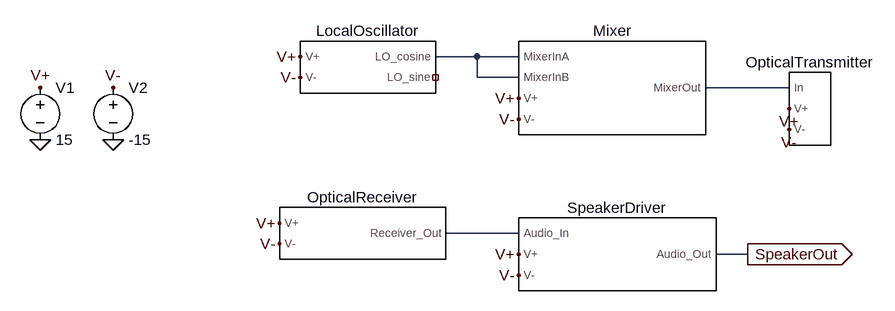
[diagram p0: schematic Combined.asc]
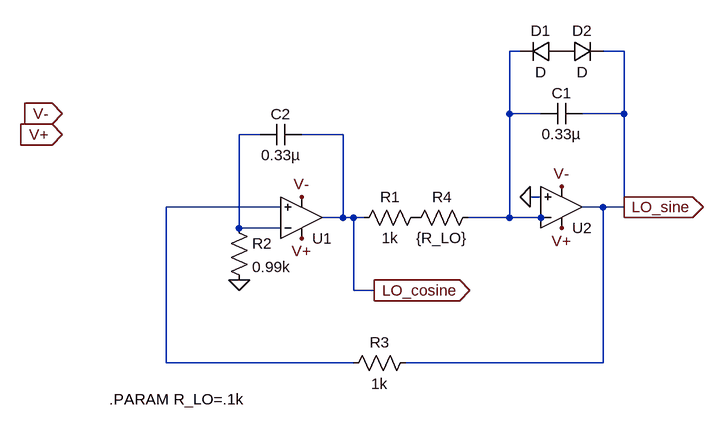
[diagram p1: sub-circuit localoscillator.asc]
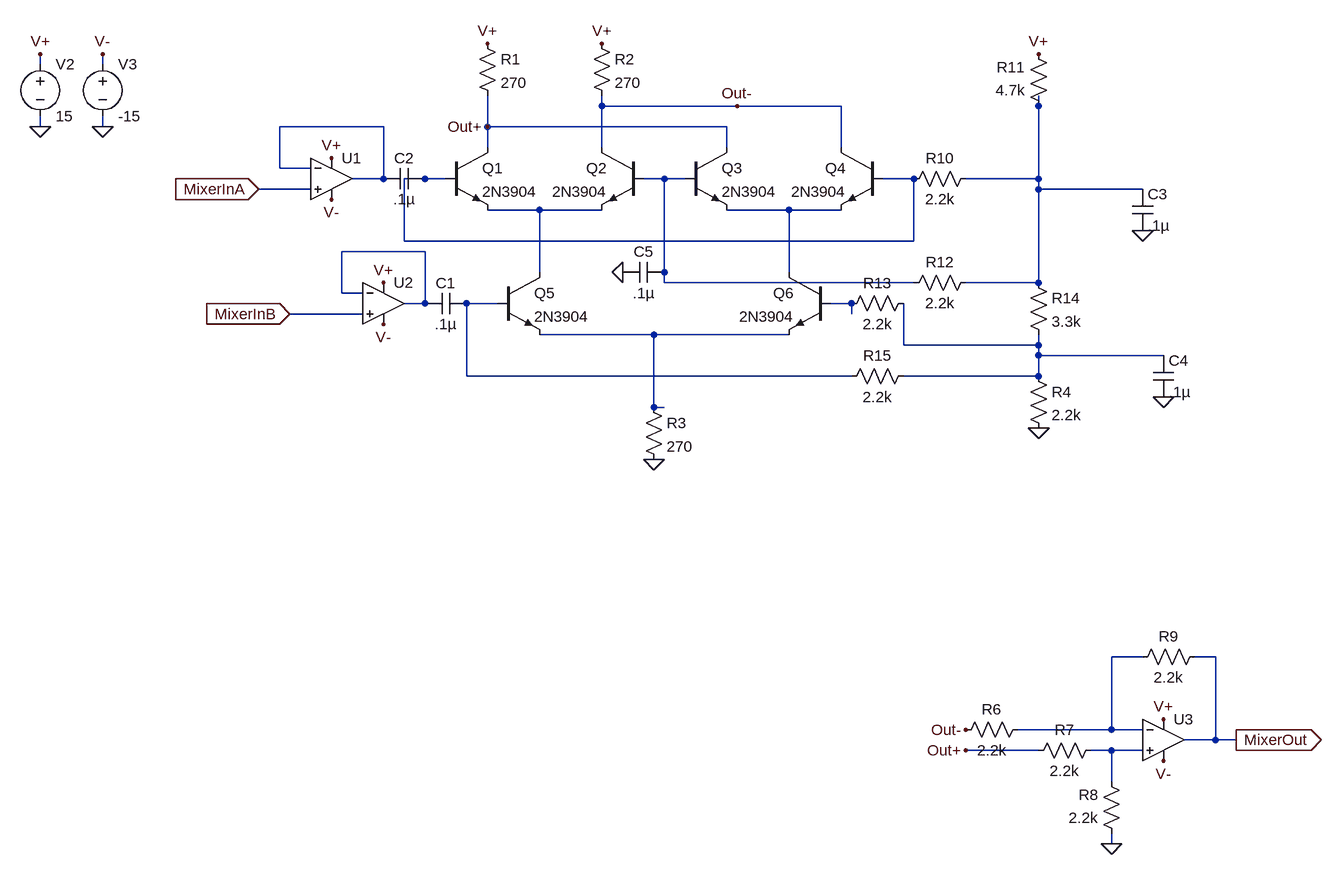
[diagram p2: sub-circuit mixer.asc]
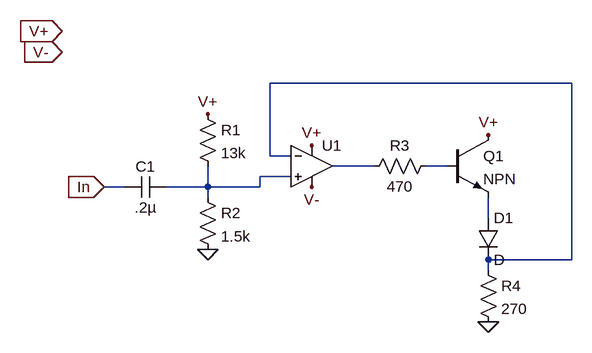
[diagram p3: sub-circuit opticaltransmitter.asc]
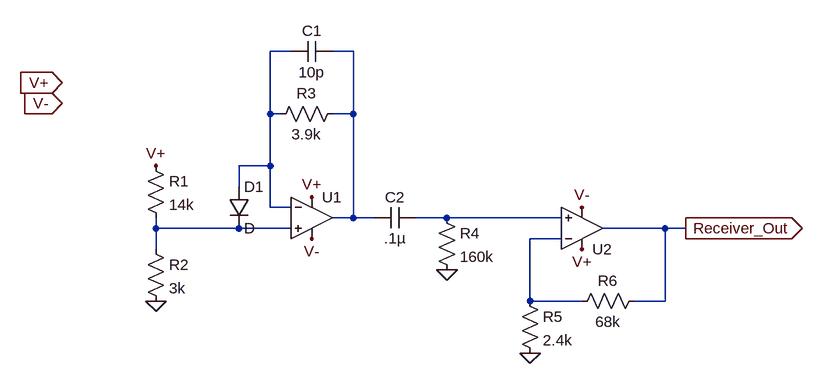
[diagram p4: sub-circuit opticalreceiver.asc]
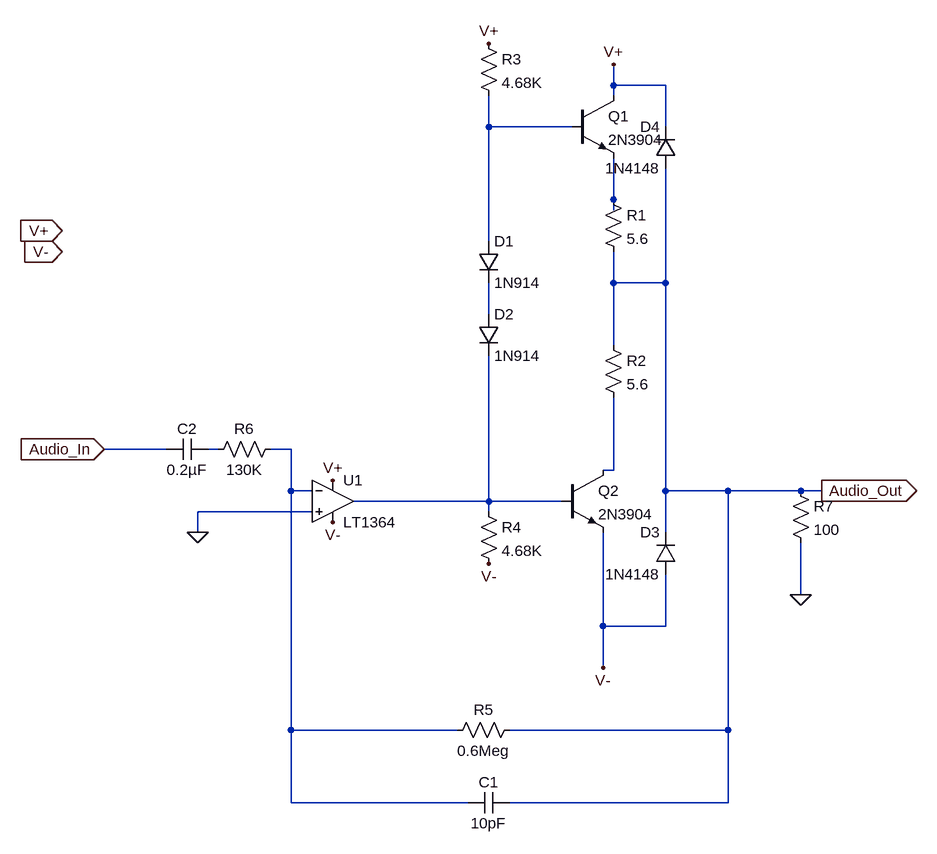
[diagram p5: sub-circuit speakerdriver.asc]
Combined.asc, the LTspice schematic file:
Version 4
SHEET 1 980 680
WIRE 288 -192 224 -192
WIRE 352 -192 288 -192
WIRE 288 -160 288 -192
WIRE 352 -160 288 -160
WIRE 768 -144 640 -144
WIRE 352 80 240 80
WIRE 704 112 656 112
FLAG -384 -64 0
FLAG -272 -64 0
FLAG 704 112 SpeakerOut
IOPIN 704 112 Out
FLAG 16 -192 V+
FLAG 352 -128 V+
FLAG 768 -112 V+
FLAG -16 64 V+
FLAG 352 112 V+
FLAG 16 -160 V-
FLAG 352 -96 V-
FLAG 768 -80 V-
FLAG -16 96 V-
FLAG 352 144 V-
FLAG -384 -144 V+
FLAG -272 -144 V-
SYMBOL voltage -384 -160 R0
WINDOW 123 0 0 Left 0
WINDOW 39 0 0 Left 0
SYMATTR InstName V1
SYMATTR Value 15
SYMBOL voltage -272 -160 R0
WINDOW 123 0 0 Left 0
WINDOW 39 0 0 Left 0
SYMATTR InstName V2
SYMATTR Value -15
SYMBOL LocalOscillator 112 -176 R0
SYMATTR InstName LocalOscillator
SYMBOL Mixer 496 -144 R0
SYMATTR InstName Mixer
SYMBOL OpticalTransmitter 800 -112 R0
SYMATTR InstName OpticalTransmitter
SYMBOL OpticalReceiver 112 80 R0
SYMATTR InstName OpticalReceiver
SYMBOL SpeakerDriver 496 112 R0
SYMATTR InstName SpeakerDriver

localoscillator.asc, the sub-circuit schematic file:
Version 4
SHEET 1 880 680
WIRE 448 -256 432 -256
WIRE 608 -256 576 -256
WIRE 432 -160 432 -256
WIRE 480 -160 432 -160
WIRE 608 -160 608 -256
WIRE 608 -160 544 -160
WIRE 48 -128 16 -128
WIRE 176 -128 112 -128
WIRE 480 -32 464 -32
WIRE 80 -16 -96 -16
WIRE 576 -16 544 -16
WIRE 608 -16 608 -160
WIRE 608 -16 576 -16
WIRE 176 0 176 -128
WIRE 176 0 144 0
WIRE 192 0 176 0
WIRE 208 0 192 0
WIRE 432 0 432 -160
WIRE 432 0 368 0
WIRE 480 0 480 -16
WIRE 480 0 432 0
WIRE 16 16 16 -128
WIRE 80 16 16 16
WIRE 192 112 192 0
WIRE 224 112 192 112
WIRE -96 224 -96 -16
WIRE 192 224 -96 224
WIRE 576 224 576 -16
WIRE 576 224 272 224
FLAG 16 96 0
FLAG 464 -32 0
FLAG 112 -32 V-
FLAG 512 -48 V-
FLAG 112 32 V+
FLAG 512 16 V+
FLAG 224 112 LO_cosine
IOPIN 224 112 Out
FLAG 608 -16 LO_sine
IOPIN 608 -16 Out
FLAG -256 -128 V+
IOPIN -256 -128 In
FLAG -256 -160 V-
IOPIN -256 -160 In
SYMBOL Opamps\\UniversalOpamp2 112 0 M180
SYMATTR InstName U1
SYMBOL res 304 -16 R90
WINDOW 0 0 56 VBottom 2
WINDOW 3 32 56 VTop 2
SYMATTR InstName R1
SYMATTR Value 1k
SYMBOL Opamps\\UniversalOpamp2 512 -16 M180
SYMATTR InstName U2
SYMBOL cap 544 -176 R90
WINDOW 0 0 32 VBottom 2
WINDOW 3 32 32 VTop 2
SYMATTR InstName C1
SYMATTR Value 0.33µ
SYMBOL diode 512 -272 R90
WINDOW 0 0 32 VBottom 2
WINDOW 3 32 32 VTop 2
SYMATTR InstName D1
SYMBOL diode 512 -240 R270
WINDOW 0 32 32 VTop 2
WINDOW 3 0 32 VBottom 2
SYMATTR InstName D2
SYMBOL cap 112 -144 R90
WINDOW 0 0 32 VBottom 2
WINDOW 3 32 32 VTop 2
SYMATTR InstName C2
SYMATTR Value 0.33µ
SYMBOL res 0 0 R0
SYMATTR InstName R2
SYMATTR Value 0.99k
SYMBOL res 288 208 R90
WINDOW 0 0 56 VBottom 2
WINDOW 3 32 56 VTop 2
SYMATTR InstName R3
SYMATTR Value 1k
SYMBOL res 384 -16 R90
WINDOW 0 0 56 VBottom 2
WINDOW 3 32 56 VTop 2
SYMATTR InstName R4
SYMATTR Value {R_LO}
TEXT -184 280 Left 2 !.PARAM R_LO=.1k

mixer.asc, the sub-circuit schematic file:
Version 4
SHEET 1 2196 1092
WIRE -240 -128 -240 -144
WIRE -144 -128 -144 -144
WIRE 624 -64 624 -80
WIRE 832 -64 624 -64
WIRE 992 -64 832 -64
WIRE 1296 -64 1296 -80
WIRE -240 -32 -240 -48
WIRE -144 -32 -144 -48
WIRE 288 -32 128 -32
WIRE 448 -32 448 -80
WIRE 816 -32 448 -32
WIRE 448 0 448 -32
WIRE 624 0 624 -64
WIRE 816 0 816 -32
WIRE 992 0 992 -64
WIRE 128 32 128 -32
WIRE 176 32 128 32
WIRE 288 48 288 -32
WIRE 288 48 240 48
WIRE 352 48 320 48
WIRE 384 48 352 48
WIRE 720 48 688 48
WIRE 752 48 720 48
WIRE 1104 48 1056 48
WIRE 1296 48 1296 -64
WIRE 1296 48 1184 48
WIRE 176 64 96 64
WIRE 1296 64 1296 48
WIRE 1456 64 1296 64
WIRE 528 96 448 96
WIRE 624 96 528 96
WIRE 912 96 816 96
WIRE 992 96 912 96
WIRE 320 144 320 48
WIRE 1104 144 1104 48
WIRE 1104 144 320 144
WIRE 352 160 224 160
WIRE 528 192 528 96
WIRE 720 192 720 48
WIRE 912 192 912 96
WIRE 720 208 720 192
WIRE 1104 208 720 208
WIRE 1296 208 1296 64
WIRE 1296 208 1184 208
WIRE 224 224 224 160
WIRE 256 224 224 224
WIRE 352 240 352 160
WIRE 352 240 320 240
WIRE 464 240 416 240
WIRE 1008 240 976 240
WIRE 256 256 144 256
WIRE 1008 256 1008 240
WIRE 704 288 528 288
WIRE 912 288 704 288
WIRE 1088 304 1088 240
WIRE 1296 304 1296 288
WIRE 1296 304 1088 304
WIRE 1296 320 1296 304
WIRE 1488 320 1296 320
WIRE 416 352 416 240
WIRE 1008 352 416 352
WIRE 1296 352 1296 320
WIRE 1296 352 1088 352
WIRE 704 400 704 288
WIRE 720 400 704 400
WIRE 1456 784 1408 784
WIRE 1568 784 1536 784
WIRE 1408 896 1408 784
WIRE 1408 896 1264 896
WIRE 1456 896 1408 896
WIRE 1568 912 1568 784
WIRE 1568 912 1520 912
WIRE 1600 912 1568 912
WIRE 1296 928 1184 928
WIRE 1408 928 1376 928
WIRE 1456 928 1408 928
WIRE 1408 976 1408 928
WIRE 1408 1072 1408 1056
FLAG -240 -32 0
FLAG -144 -32 0
FLAG 208 16 V+
FLAG 208 80 V-
FLAG 288 272 V-
FLAG 288 208 V+
FLAG 448 -160 V+
FLAG 624 -160 V+
FLAG 1488 944 V-
FLAG 1488 880 V+
FLAG 1408 1072 0
FLAG 448 -32 Out+
FLAG 1184 928 Out+
FLAG 832 -64 Out-
FLAG 1184 896 Out-
FLAG 704 480 0
FLAG 1296 432 0
FLAG 1296 -144 V+
FLAG 1488 384 0
FLAG 1456 128 0
FLAG 656 192 0
FLAG 1600 912 MixerOut
IOPIN 1600 912 Out
FLAG 96 64 MixerInA
IOPIN 96 64 In
FLAG 144 256 MixerInB
IOPIN 144 256 In
FLAG -240 -144 V+
FLAG -144 -144 V-
SYMBOL voltage -240 -144 R0
WINDOW 123 0 0 Left 0
WINDOW 39 0 0 Left 0
SYMATTR InstName V2
SYMATTR Value 15
SYMBOL voltage -144 -144 R0
WINDOW 123 0 0 Left 0
WINDOW 39 0 0 Left 0
SYMATTR InstName V3
SYMATTR Value -15
SYMBOL Opamps\\UniversalOpamp2 208 48 R0
SYMATTR InstName U1
SYMBOL res 432 -176 R0
SYMATTR InstName R1
SYMATTR Value 270
SYMBOL npn 384 0 R0
SYMATTR InstName Q1
SYMATTR Value 2N3904
SYMBOL npn 688 0 M0
SYMATTR InstName Q2
SYMATTR Value 2N3904
SYMBOL npn 752 0 R0
SYMATTR InstName Q3
SYMATTR Value 2N3904
SYMBOL npn 1056 0 M0
SYMATTR InstName Q4
SYMATTR Value 2N3904
SYMBOL res 608 -176 R0
SYMATTR InstName R2
SYMATTR Value 270
SYMBOL npn 464 192 R0
SYMATTR InstName Q5
SYMATTR Value 2N3904
SYMBOL npn 976 192 M0
SYMATTR InstName Q6
SYMATTR Value 2N3904
SYMBOL Opamps\\UniversalOpamp2 288 240 R0
SYMATTR InstName U2
SYMBOL Opamps\\UniversalOpamp2 1488 912 R0
SYMATTR InstName U3
SYMBOL res 1280 880 R90
WINDOW 0 0 56 VBottom 2
WINDOW 3 32 56 VTop 2
SYMATTR InstName R6
SYMATTR Value 2.2k
SYMBOL res 1392 912 R90
WINDOW 0 0 56 VBottom 2
WINDOW 3 32 56 VTop 2
SYMATTR InstName R7
SYMATTR Value 2.2k
SYMBOL res 1424 1072 R180
WINDOW 0 36 76 Left 2
WINDOW 3 36 40 Left 2
SYMATTR InstName R8
SYMATTR Value 2.2k
SYMBOL res 1440 800 R270
WINDOW 0 32 56 VTop 2
WINDOW 3 0 56 VBottom 2
SYMATTR InstName R9
SYMATTR Value 2.2k
SYMBOL res 1200 32 R90
WINDOW 0 0 56 VBottom 2
WINDOW 3 32 56 VTop 2
SYMATTR InstName R10
SYMATTR Value 2.2k
SYMBOL res 1312 -48 R180
WINDOW 0 36 76 Left 2
WINDOW 3 36 40 Left 2
SYMATTR InstName R11
SYMATTR Value 4.7k
SYMBOL res 1088 224 R270
WINDOW 0 32 56 VTop 2
WINDOW 3 0 56 VBottom 2
SYMATTR InstName R12
SYMATTR Value 2.2k
SYMBOL res 992 256 R270
WINDOW 0 32 56 VTop 2
WINDOW 3 0 56 VBottom 2
SYMATTR InstName R13
SYMATTR Value 2.2k
SYMBOL res 1280 192 R0
SYMATTR InstName R14
SYMATTR Value 3.3k
SYMBOL res 1104 336 R90
WINDOW 0 0 56 VBottom 2
WINDOW 3 32 56 VTop 2
SYMATTR InstName R15
SYMATTR Value 2.2k
SYMBOL res 688 384 R0
SYMATTR InstName R3
SYMATTR Value 270
SYMBOL res 1280 336 R0
SYMATTR InstName R4
SYMATTR Value 2.2k
SYMBOL cap 416 224 R90
WINDOW 0 0 32 VBottom 2
WINDOW 3 32 32 VTop 2
SYMATTR InstName C1
SYMATTR Value .1µ
SYMBOL cap 352 32 R90
WINDOW 0 0 32 VBottom 2
WINDOW 3 32 32 VTop 2
SYMATTR InstName C2
SYMATTR Value .1µ
SYMBOL cap 1440 64 R0
SYMATTR InstName C3
SYMATTR Value .1µ
SYMBOL cap 1472 320 R0
SYMATTR InstName C4
SYMATTR Value .1µ
SYMBOL cap 720 176 R90
WINDOW 0 0 32 VBottom 2
WINDOW 3 32 32 VTop 2
SYMATTR InstName C5
SYMATTR Value .1µ

opticaltransmitter.asc, the sub-circuit schematic file:
Version 4
SHEET 1 880 680
WIRE 368 -96 -96 -96
WIRE -96 16 -96 -96
WIRE -64 16 -96 16
WIRE 64 32 0 32
WIRE 176 32 144 32
WIRE -64 48 -112 48
WIRE -320 64 -352 64
WIRE -192 64 -192 32
WIRE -192 64 -256 64
WIRE -112 64 -112 48
WIRE -112 64 -192 64
WIRE -192 80 -192 64
WIRE 240 112 240 80
WIRE 240 176 240 160
WIRE 368 176 368 -96
WIRE 368 176 240 176
WIRE 240 192 240 176
FLAG -416 -176 V+
IOPIN -416 -176 In
FLAG -416 -144 V-
IOPIN -416 -144 In
FLAG -32 0 V+
FLAG -32 64 V-
FLAG -352 64 In
IOPIN -352 64 In
FLAG -192 160 0
FLAG 240 272 0
FLAG 240 -16 V+
FLAG -192 -48 V+
SYMBOL Opamps\\UniversalOpamp2 -32 32 R0
SYMATTR InstName U1
SYMBOL res -208 -64 R0
SYMATTR InstName R1
SYMATTR Value 13k
SYMBOL res -208 64 R0
SYMATTR InstName R2
SYMATTR Value 1.5k
SYMBOL cap -256 48 R90
WINDOW 0 0 32 VBottom 2
WINDOW 3 32 32 VTop 2
SYMATTR InstName C1
SYMATTR Value .2µ
SYMBOL res 160 16 R90
WINDOW 0 0 56 VBottom 2
WINDOW 3 32 56 VTop 2
SYMATTR InstName R3
SYMATTR Value 470
SYMBOL npn 176 -16 R0
SYMATTR InstName Q1
SYMBOL diode 224 112 R0
SYMATTR InstName D1
SYMBOL res 224 176 R0
SYMATTR InstName R4
SYMATTR Value 270

opticalreceiver.asc, the sub-circuit schematic file:
Version 4
SHEET 1 880 680
WIRE -64 -224 -96 -224
WIRE 32 -224 0 -224
WIRE -96 -128 -96 -224
WIRE -80 -128 -96 -128
WIRE 32 -128 32 -224
WIRE 32 -128 0 -128
WIRE -96 -48 -96 -128
WIRE -96 -48 -144 -48
WIRE -144 -16 -144 -48
WIRE -96 16 -96 -48
WIRE -64 16 -96 16
WIRE 32 32 32 -128
WIRE 32 32 0 32
WIRE 64 32 32 32
WIRE 176 32 128 32
WIRE 352 32 176 32
WIRE -272 48 -272 32
WIRE -144 48 -272 48
WIRE -64 48 -144 48
WIRE 512 48 416 48
WIRE 544 48 512 48
WIRE 352 64 304 64
WIRE -272 80 -272 48
WIRE 304 160 304 64
WIRE 384 160 304 160
WIRE 512 160 512 48
WIRE 512 160 464 160
FLAG -272 160 0
FLAG 176 112 0
FLAG 304 240 0
FLAG -416 -176 V+
IOPIN -416 -176 In
FLAG -416 -144 V-
IOPIN -416 -144 In
FLAG -272 -48 V+
FLAG -32 0 V+
FLAG 384 80 V+
FLAG -32 64 V-
FLAG 384 16 V-
FLAG 544 48 Receiver_Out
IOPIN 544 48 Out
SYMBOL Opamps\\UniversalOpamp2 -32 32 R0
SYMATTR InstName U1
SYMBOL diode -160 -16 R0
SYMATTR InstName D1
SYMBOL res -288 -64 R0
SYMATTR InstName R1
SYMATTR Value 14k
SYMBOL res -288 64 R0
SYMATTR InstName R2
SYMATTR Value 3k
SYMBOL res 16 -144 R90
WINDOW 0 0 56 VBottom 2
WINDOW 3 32 56 VTop 2
SYMATTR InstName R3
SYMATTR Value 3.9k
SYMBOL cap 0 -240 R90
WINDOW 0 0 32 VBottom 2
WINDOW 3 32 32 VTop 2
SYMATTR InstName C1
SYMATTR Value 10p
SYMBOL cap 128 16 R90
WINDOW 0 0 32 VBottom 2
WINDOW 3 32 32 VTop 2
SYMATTR InstName C2
SYMATTR Value .1µ
SYMBOL res 160 16 R0
SYMATTR InstName R4
SYMATTR Value 160k
SYMBOL Opamps\\UniversalOpamp2 384 48 M180
SYMATTR InstName U2
SYMBOL res 288 144 R0
SYMATTR InstName R5
SYMATTR Value 2.4k
SYMBOL res 480 144 R90
WINDOW 0 0 56 VBottom 2
WINDOW 3 32 56 VTop 2
SYMATTR InstName R6
SYMATTR Value 68k

speakerdriver.asc, the sub-circuit schematic file:
Version 4
SHEET 1 880 1204
WIRE 336 32 336 0
WIRE 416 32 336 32
WIRE 336 48 336 32
WIRE 144 96 144 48
WIRE 272 96 144 96
WIRE 416 96 416 32
WIRE 336 208 336 144
WIRE 336 224 336 208
WIRE 144 272 144 96
WIRE 336 336 336 288
WIRE 416 336 416 160
WIRE 416 336 336 336
WIRE 144 384 144 336
WIRE 336 432 336 336
WIRE -352 592 -448 592
WIRE -272 592 -288 592
WIRE -160 592 -192 592
WIRE 336 624 336 512
WIRE 336 624 320 624
WIRE -160 656 -160 592
WIRE -128 656 -160 656
WIRE 416 656 416 336
WIRE 512 656 416 656
WIRE 624 656 512 656
WIRE 656 656 624 656
WIRE 144 672 144 448
WIRE 144 672 -64 672
WIRE 256 672 144 672
WIRE -128 688 -304 688
WIRE 144 688 144 672
WIRE -304 720 -304 688
WIRE 416 720 416 656
WIRE 624 816 624 736
WIRE 320 864 320 720
WIRE 416 864 416 784
WIRE 416 864 320 864
WIRE 320 928 320 864
WIRE -160 1024 -160 656
WIRE 96 1024 -160 1024
WIRE 512 1024 512 656
WIRE 512 1024 176 1024
WIRE -160 1136 -160 1024
WIRE 112 1136 -160 1136
WIRE 512 1136 512 1024
WIRE 512 1136 176 1136
FLAG -448 592 Audio_In
IOPIN -448 592 In
FLAG 656 656 Audio_Out
IOPIN 656 656 Out
FLAG -304 720 0
FLAG 624 816 0
FLAG -512 256 V+
IOPIN -512 256 In
FLAG -512 288 V-
IOPIN -512 288 In
FLAG -96 640 V+
FLAG 144 -32 V+
FLAG 336 0 V+
FLAG -96 704 V-
FLAG 144 768 V-
FLAG 320 928 V-
SYMBOL npn 256 624 R0
SYMATTR InstName Q2
SYMATTR Value 2N3904
SYMBOL res 320 192 R0
SYMATTR InstName R1
SYMATTR Value 5.6
SYMBOL res 320 416 R0
SYMATTR InstName R2
SYMATTR Value 5.6
SYMBOL diode 128 272 R0
SYMATTR InstName D1
SYMATTR Value 1N914
SYMBOL diode 128 384 R0
SYMATTR InstName D2
SYMATTR Value 1N914
SYMBOL res 128 -48 R0
SYMATTR InstName R3
SYMATTR Value 4.68K
SYMBOL res 128 672 R0
SYMATTR InstName R4
SYMATTR Value 4.68K
SYMBOL diode 432 784 R180
WINDOW 0 24 64 Left 2
WINDOW 3 24 0 Left 2
SYMATTR InstName D3
SYMATTR Value 1N4148
SYMBOL diode 432 160 R180
WINDOW 0 24 64 Left 2
WINDOW 3 24 0 Left 2
SYMATTR InstName D4
SYMATTR Value 1N4148
SYMBOL npn 272 48 R0
SYMATTR InstName Q1
SYMATTR Value 2N3904
SYMBOL res 192 1008 R90
WINDOW 0 0 56 VBottom 2
WINDOW 3 32 56 VTop 2
SYMATTR InstName R5
SYMATTR Value 0.6Meg
SYMBOL cap 176 1120 R90
WINDOW 0 0 32 VBottom 2
WINDOW 3 32 32 VTop 2
SYMATTR InstName C1
SYMATTR Value 10pF
SYMBOL cap -288 576 R90
WINDOW 0 0 32 VBottom 2
WINDOW 3 32 32 VTop 2
SYMATTR InstName C2
SYMATTR Value 0.2µF
SYMBOL res -176 576 R90
WINDOW 0 0 56 VBottom 2
WINDOW 3 32 56 VTop 2
SYMATTR InstName R6
SYMATTR Value 130K
SYMBOL res 608 640 R0
SYMATTR InstName R7
SYMATTR Value 100
SYMBOL Opamps\\LT1364 -96 608 R0
SYMATTR InstName U1

The netlist it stands for:
* Combined.asc
V1 V+ 0 15
V2 V- 0 -15
XLocalOscillator V+ V- N001 NC_01 localoscillator
XMixer N001 N001 V+ V- N002 mixer
XOpticalTransmitter N002 V+ V- opticaltransmitter
XOpticalReceiver V+ V- N003 opticalreceiver
XSpeakerDriver N003 V+ V- SpeakerOut speakerdriver

* block symbol definitions
.subckt localoscillator V+ V- LO_cosine LO_sine
XU1 N003 N002 V+ V- LO_cosine level.2 Avol=1Meg GBW=10Meg Slew=10Meg ilimit=25m rail=0 Vos=0 phimargin=45 en=0 enk=0 in=0 ink=0 Rin=500Meg  ; pins IN+ IN- V+ V- OUT
R1 P001 LO_cosine 1k
XU2 0 N001 V+ V- LO_sine level.2 Avol=1Meg GBW=10Meg Slew=10Meg ilimit=25m rail=0 Vos=0 phimargin=45 en=0 enk=0 in=0 ink=0 Rin=500Meg  ; pins IN+ IN- V+ V- OUT
C1 LO_sine N001 0.33µ
D1 P002 N001 D
D2 P002 LO_sine D
C2 LO_cosine N002 0.33µ
R2 N002 0 0.99k
R3 LO_sine N003 1k
R4 N001 P001 {R_LO}
.PARAM R_LO=.1k
.ends localoscillator

.subckt mixer MixerInA MixerInB V+ V- MixerOut
V2 V+ 0 15
V3 V- 0 -15
XU1 MixerInA N002 V+ V- N002 level.2 Avol=1Meg GBW=10Meg Slew=10Meg ilimit=25m rail=0 Vos=0 phimargin=45 en=0 enk=0 in=0 ink=0 Rin=500Meg  ; pins IN+ IN- V+ V- OUT
R1 V+ Out+ 270
Q1 Out+ N003 N005 0 2N3904
Q2 Out- N004 N005 0 2N3904
Q3 Out+ N004 N006 0 2N3904
Q4 Out- N003 N006 0 2N3904
R2 V+ Out- 270
Q5 N005 N008 N010 0 2N3904
Q6 N006 N009 N010 0 2N3904
XU2 MixerInB N007 V+ V- N007 level.2 Avol=1Meg GBW=10Meg Slew=10Meg ilimit=25m rail=0 Vos=0 phimargin=45 en=0 enk=0 in=0 ink=0 Rin=500Meg  ; pins IN+ IN- V+ V- OUT
XU3 N013 N012 V+ V- MixerOut level.2 Avol=1Meg GBW=10Meg Slew=10Meg ilimit=25m rail=0 Vos=0 phimargin=45 en=0 enk=0 in=0 ink=0 Rin=500Meg  ; pins IN+ IN- V+ V- OUT
R6 N012 Out- 2.2k
R7 N013 Out+ 2.2k
R8 0 N013 2.2k
R9 N012 MixerOut 2.2k
R10 N001 N003 2.2k
R11 N001 V+ 4.7k
R12 N004 N001 2.2k
R13 N009 N011 2.2k
R14 N001 N011 3.3k
R15 N011 N008 2.2k
R3 N010 0 270
R4 N011 0 2.2k
C1 N008 N007 .1µ
C2 N003 N002 .1µ
C3 N001 0 .1µ
C4 N011 0 .1µ
C5 N004 0 .1µ
.ends mixer

.subckt opticaltransmitter In V+ V-
XU1 N004 N001 V+ V- N002 level.2 Avol=1Meg GBW=10Meg Slew=10Meg ilimit=25m rail=0 Vos=0 phimargin=45 en=0 enk=0 in=0 ink=0 Rin=500Meg  ; pins IN+ IN- V+ V- OUT
R1 V+ N004 13k
R2 N004 0 1.5k
C1 N004 In .2µ
R3 N003 N002 470
Q1 V+ N003 N005 0 NPN
D1 N005 N001 D
R4 N001 0 270
.ends opticaltransmitter

.subckt opticalreceiver V+ V- Receiver_Out
XU1 N004 N001 V+ V- N002 level.2 Avol=1Meg GBW=10Meg Slew=10Meg ilimit=25m rail=0 Vos=0 phimargin=45 en=0 enk=0 in=0 ink=0 Rin=500Meg  ; pins IN+ IN- V+ V- OUT
D1 N001 N004 D
R1 V+ N004 14k
R2 N004 0 3k
R3 N002 N001 3.9k
C1 N002 N001 10p
C2 N003 N002 .1µ
R4 N003 0 160k
XU2 N003 N005 V+ V- Receiver_Out level.2 Avol=1Meg GBW=10Meg Slew=10Meg ilimit=25m rail=0 Vos=0 phimargin=45 en=0 enk=0 in=0 ink=0 Rin=500Meg  ; pins IN+ IN- V+ V- OUT
R5 N005 0 2.4k
R6 Receiver_Out N005 68k
.ends opticalreceiver

.subckt speakerdriver Audio_In V+ V- Audio_Out
Q2 N006 N007 V- 0 2N3904
R1 N002 Audio_Out 5.6
R2 Audio_Out N006 5.6
D1 N001 N003 1N914
D2 N003 N007 1N914
R3 V+ N001 4.68K
R4 N007 V- 4.68K
D3 V- Audio_Out 1N4148
D4 Audio_Out V+ 1N4148
Q1 V+ N001 N002 0 2N3904
R5 Audio_Out N005 0.6Meg
C1 Audio_Out N005 10pF
C2 N004 Audio_In 0.2µF
R6 N005 N004 130K
R7 Audio_Out 0 100
XU1 0 N005 V+ V- N007 LT1363  ; LT1364, pins In+ In- V+ V- OUT
.ends speakerdriver

.model D D
.lib standard.dio
.model NPN NPN
.model PNP PNP
.lib standard.bjt
.lib UniversalOpamps2.sub
.lib LTC.lib
.backanno
.end